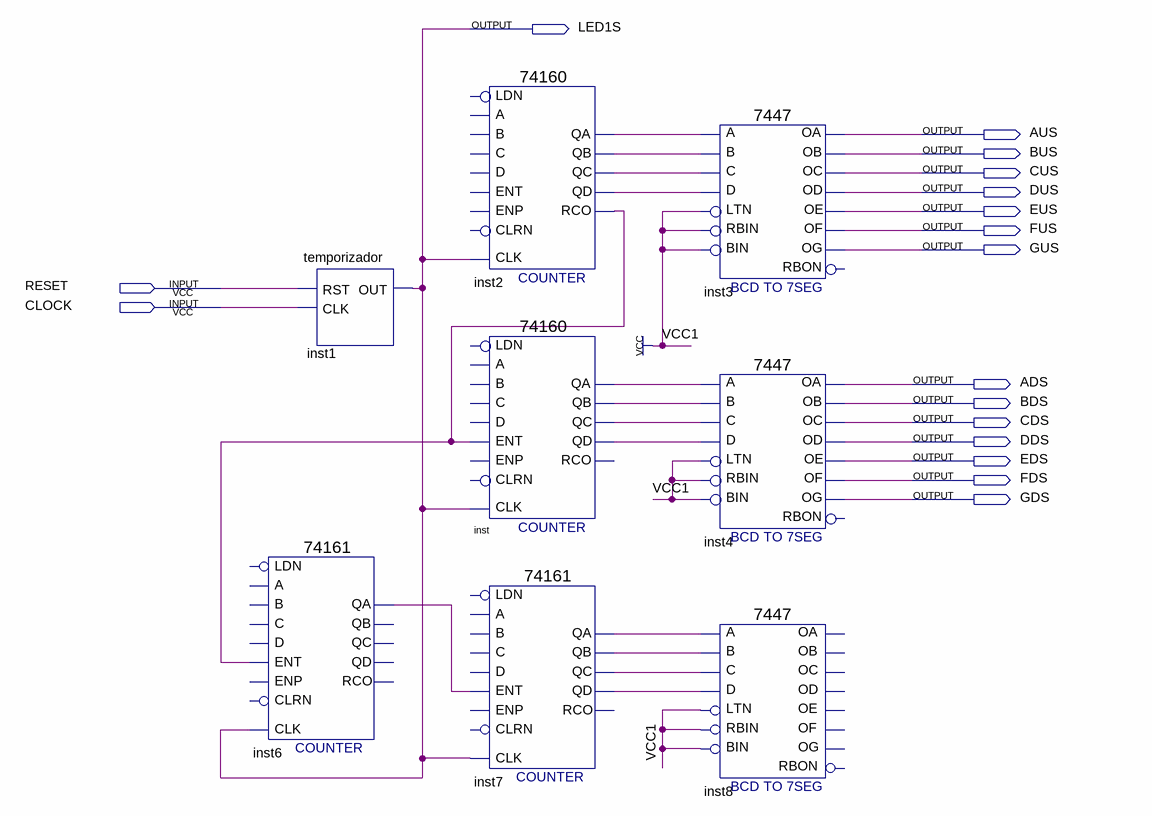
[diagram p0: schematic sheet]
// Quartus schematic minutos.bdf as structural Verilog: 8 symbols, 17 pins
module minutos (
  input  RESET,
  input  CLOCK,
  output LED1S,
  output AUS,
  output BUS,
  output CUS,
  output DUS,
  output EUS,
  output FUS,
  output GUS,
  output ADS,
  output BDS,
  output CDS,
  output DDS,
  output EDS,
  output FDS,
  output GDS
);

  wire inst2_qa, inst2_qb, inst2_qc, inst2_qd, inst2_rco, inst6_qa, inst7_qa, inst7_qb, inst7_qc, inst7_qd,
       inst_qa, inst_qb, inst_qc, inst_qd;

  temporizador inst1 (.RST(RESET), .CLK(CLOCK), .OUT(LED1S));
  \74161  inst6 (.CLK(LED1S), .ENT(inst2_rco), .QA(inst6_qa));  // open: CLRN, ENP, LDN, A, D, B, C, QD, QC, QB, RCO
  \74160  inst2 (
    .CLK(LED1S), .QD(inst2_qd), .QA(inst2_qa), .QB(inst2_qb), .QC(inst2_qc), .RCO(inst2_rco));  // open: ENT, A, B, C, D, LDN, ENP, CLRN
  \74160  inst (
    .CLK(LED1S), .ENT(inst2_rco), .QD(inst_qd), .QA(inst_qa), .QB(inst_qb), .QC(inst_qc));  // open: A, B, C, D, LDN, ENP, CLRN, RCO
  \74161  inst7 (
    .CLK(LED1S), .ENT(inst6_qa), .QD(inst7_qd), .QC(inst7_qc), .QB(inst7_qb), .QA(inst7_qa));  // open: CLRN, ENP, LDN, A, D, B, C, RCO
  \7447  inst3 (
    .LTN(1'b1), .B(inst2_qb), .C(inst2_qc), .D(inst2_qd), .RBIN(1'b1), .BIN(1'b1), .A(inst2_qa), .OB(BUS),
    .OC(CUS), .OE(EUS), .OD(DUS), .OF(FUS), .OG(GUS), .OA(AUS));  // open: RBON
  \7447  inst4 (
    .LTN(1'b1), .B(inst_qb), .C(inst_qc), .D(inst_qd), .RBIN(1'b1), .BIN(1'b1), .A(inst_qa), .OB(BDS),
    .OC(CDS), .OE(EDS), .OD(DDS), .OF(FDS), .OG(GDS), .OA(ADS));  // open: RBON
  \7447  inst8 (
    .LTN(1'b1), .B(inst7_qb), .C(inst7_qc), .D(inst7_qd), .RBIN(1'b1), .BIN(1'b1), .A(inst7_qa));  // open: OB, OC, OE, OD, OF, OG, OA, RBON
endmodule
